# Altium schematic sheet Sensors_Sch.SchDoc
size B
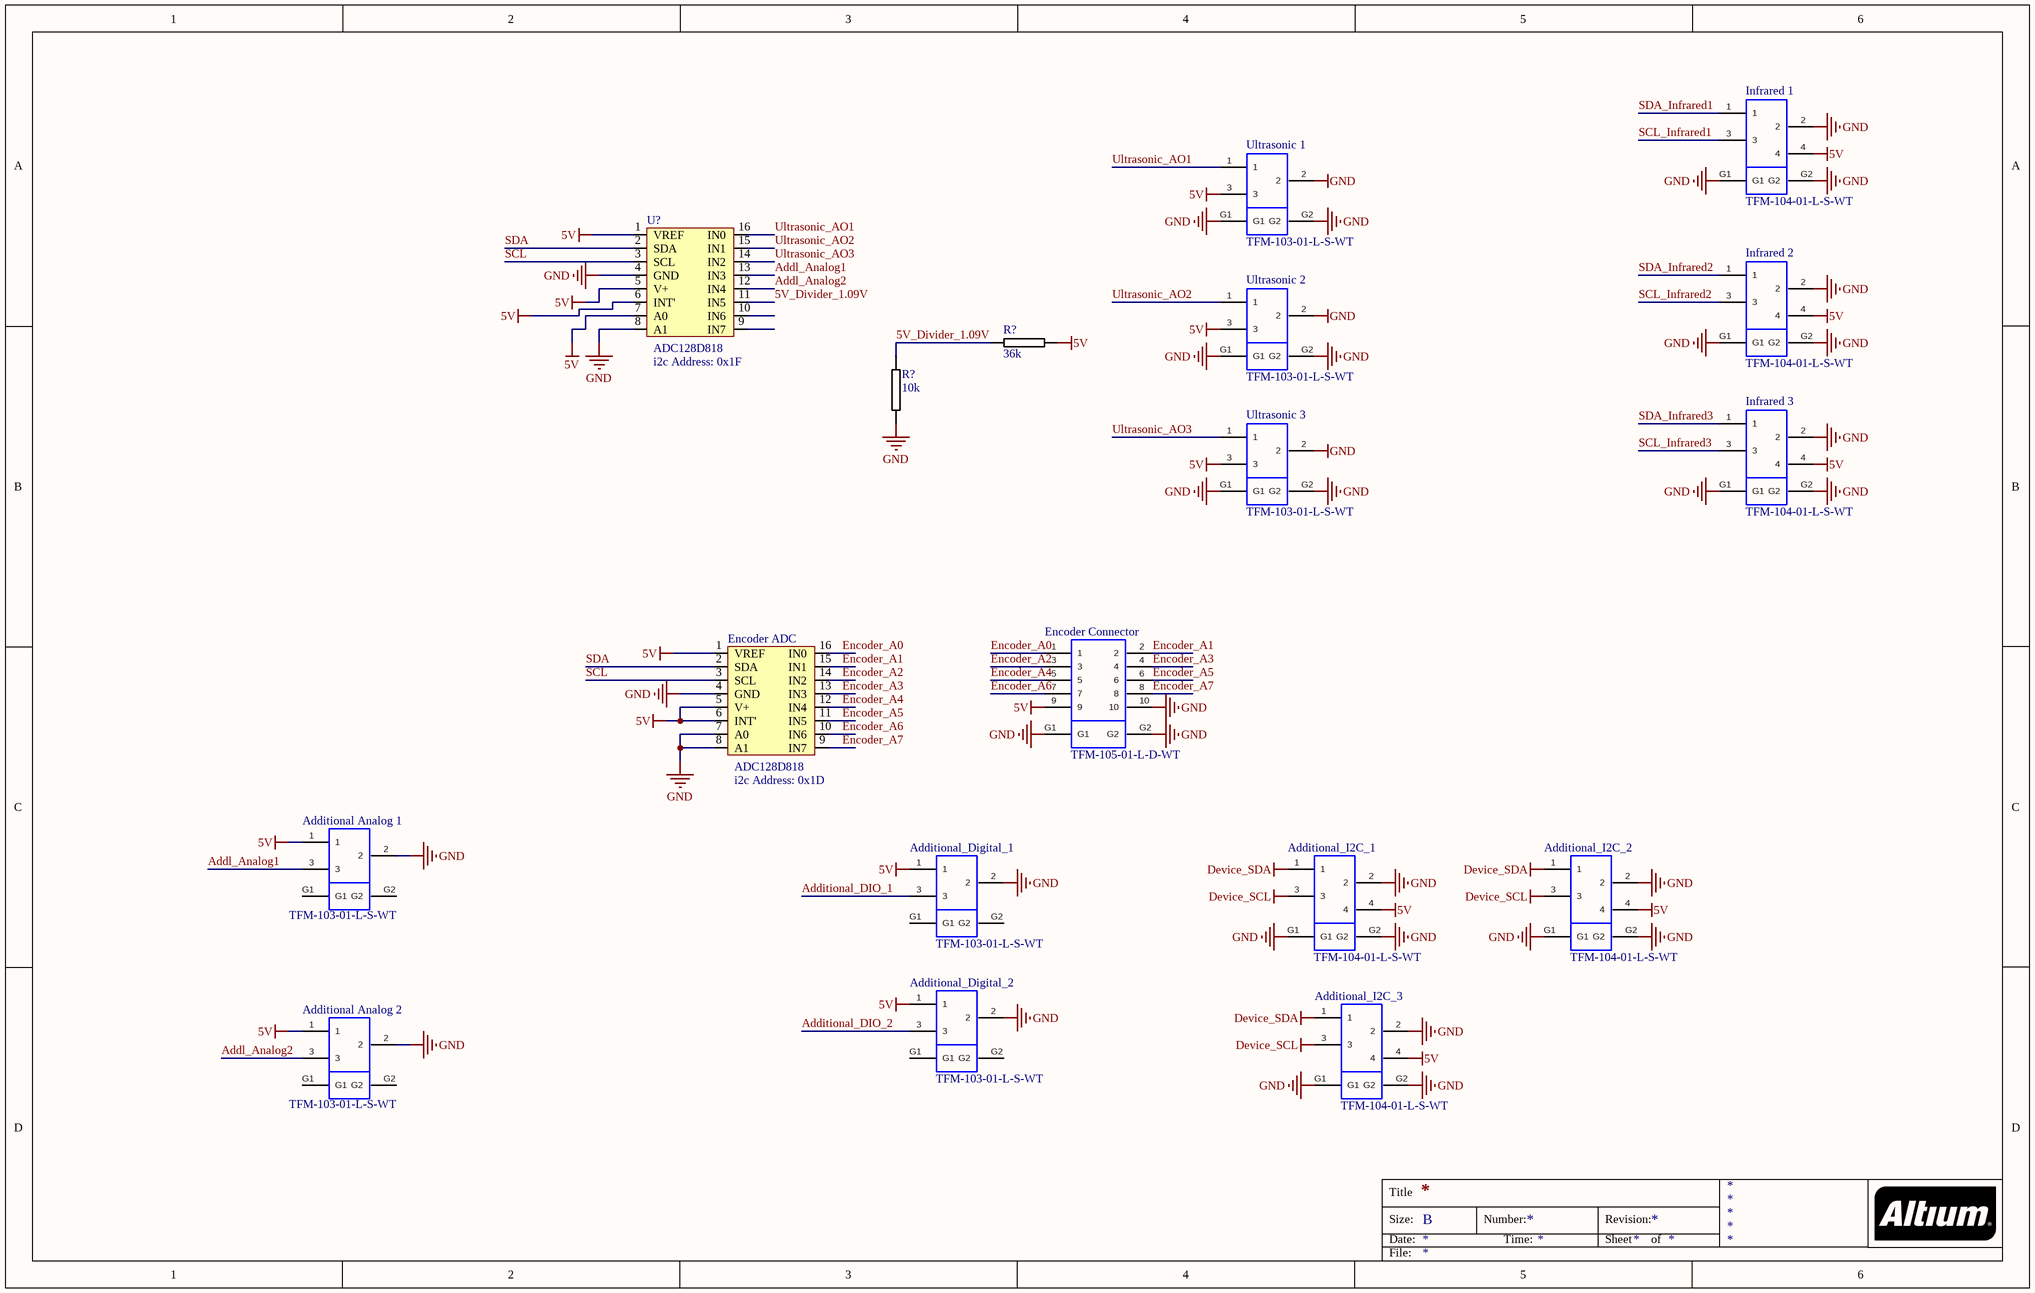
[diagram p0: Sensors_Sch.SchDoc]

## Parts
(Parts that share a designator on the sheet are numbered #1, #2 ... from top to bottom, then left to right.)
Additional_Analog_1  TFM-103-01-L-S-WT  [TFM-103-01-L-S-WT]
Additional_Analog_2  TFM-103-01-L-S-WT  [TFM-103-01-L-S-WT]
Additional_Digital_1  TFM-103-01-L-S-WT  [TFM-103-01-L-S-WT]
Additional_Digital_2  TFM-103-01-L-S-WT  [TFM-103-01-L-S-WT]
Additional_I2C_1  TFM-104-01-L-S-WT  [TFM-104-01-L-S-WT]
Additional_I2C_2  TFM-104-01-L-S-WT  [TFM-104-01-L-S-WT]
Additional_I2C_3  TFM-104-01-L-S-WT  [TFM-104-01-L-S-WT]
Encoder_ADC  ADC128D818  i2c Address: 0x1D  [ADC128D818 V3]
Encoder_Connector  TFM-105-01-L-D-WT  [TFM-105-01-L-D-WT]
Infrared_1  TFM-104-01-L-S-WT  [TFM-104-01-L-S-WT]
Infrared_2  TFM-104-01-L-S-WT  [TFM-104-01-L-S-WT]
Infrared_3  TFM-104-01-L-S-WT  [TFM-104-01-L-S-WT]
R?#1  36k  [0805R-GENERIC]
R?#2  10k  [0805R-GENERIC]
U?  ADC128D818  i2c Address: 0x1F  [ADC128D818 V3]
Ultrasonic_1  TFM-103-01-L-S-WT  [TFM-103-01-L-S-WT]
Ultrasonic_2  TFM-103-01-L-S-WT  [TFM-103-01-L-S-WT]
Ultrasonic_3  TFM-103-01-L-S-WT  [TFM-103-01-L-S-WT]

## Nets
5V: Additional_Analog_1.1 Additional_Analog_2.1 Additional_Digital_1.1 Additional_Digital_2.1 Additional_I2C_1.4 Additional_I2C_2.4 Additional_I2C_3.4 Encoder_ADC.1(VREF) Encoder_ADC.5(V+) Encoder_ADC.6(INT') Encoder_Connector.9 Infrared_1.4 Infrared_2.4 Infrared_3.4 R?#1.2 U?.1(VREF) U?.5(V+) U?.6(INT') U?.7(A0) Ultrasonic_1.3 Ultrasonic_2.3 Ultrasonic_3.3
Device_SCL: Additional_I2C_1.3 Additional_I2C_2.3 Additional_I2C_3.3
Device_SDA: Additional_I2C_1.1 Additional_I2C_2.1 Additional_I2C_3.1
GND: Additional_Analog_1.2 Additional_Analog_2.2 Additional_Digital_1.2 Additional_Digital_2.2 Additional_I2C_1.2 Additional_I2C_1.G1 Additional_I2C_1.G2 Additional_I2C_2.2 Additional_I2C_2.G1 Additional_I2C_2.G2 Additional_I2C_3.2 Additional_I2C_3.G1 Additional_I2C_3.G2 Encoder_ADC.4(GND) Encoder_ADC.7(A0) Encoder_ADC.8(A1) Encoder_Connector.10 Encoder_Connector.G1 Encoder_Connector.G2 Infrared_1.2 Infrared_1.G1 Infrared_1.G2 Infrared_2.2 Infrared_2.G1 Infrared_2.G2 Infrared_3.2 Infrared_3.G1 Infrared_3.G2 R?#2.2 U?.4(GND) U?.8(A1) Ultrasonic_1.2 Ultrasonic_1.G1 Ultrasonic_1.G2 Ultrasonic_2.2 Ultrasonic_2.G1 Ultrasonic_2.G2 Ultrasonic_3.2 Ultrasonic_3.G1 Ultrasonic_3.G2
5V_Divider_1.09V: R?#1.1 R?#2.1 U?.11(IN5)
Additional_DIO_1: Additional_Digital_1.3
Additional_DIO_2: Additional_Digital_2.3
Addl_Analog1: Additional_Analog_1.3 U?.13(IN3)
Addl_Analog2: Additional_Analog_2.3 U?.12(IN4)
Encoder_A0: Encoder_ADC.16(IN0) Encoder_Connector.1
Encoder_A1: Encoder_ADC.15(IN1) Encoder_Connector.2
Encoder_A2: Encoder_ADC.14(IN2) Encoder_Connector.3
Encoder_A3: Encoder_ADC.13(IN3) Encoder_Connector.4
Encoder_A4: Encoder_ADC.12(IN4) Encoder_Connector.5
Encoder_A5: Encoder_ADC.11(IN5) Encoder_Connector.6
Encoder_A6: Encoder_ADC.10(IN6) Encoder_Connector.7
Encoder_A7: Encoder_ADC.9(IN7) Encoder_Connector.8
SCL: Encoder_ADC.3(SCL) U?.3(SCL)
SCL_Infrared1: Infrared_1.3
SCL_Infrared2: Infrared_2.3
SCL_Infrared3: Infrared_3.3
SDA: Encoder_ADC.2(SDA) U?.2(SDA)
SDA_Infrared1: Infrared_1.1
SDA_Infrared2: Infrared_2.1
SDA_Infrared3: Infrared_3.1
Ultrasonic_AO1: U?.16(IN0) Ultrasonic_1.1
Ultrasonic_AO2: U?.15(IN1) Ultrasonic_2.1
Ultrasonic_AO3: U?.14(IN2) Ultrasonic_3.1

Not connected (* = marked no-connect by the designer): Additional_Analog_1 G1 G2; Additional_Analog_2 G1 G2; Additional_Digital_1 G1 G2; Additional_Digital_2 G1 G2; U? 9(IN7) 10(IN6)

## Notes on the sheet
- Title
- Size:
- Date:
- B
- Number:
- Time:
- Revision:
- Sheet
- of
- File:

## Library data of the parts
Encoder_ADC = ADC128D818: i2c address = "0x1D"
R?#1 R?#2 = 0805R-TBD: RESISTOR 0805 VALUE TO BE DETERMINED
U? = ADC128D818: i2c address = "0x1F"